# Altium schematic sheet ADC_part3.SchDoc
size A4
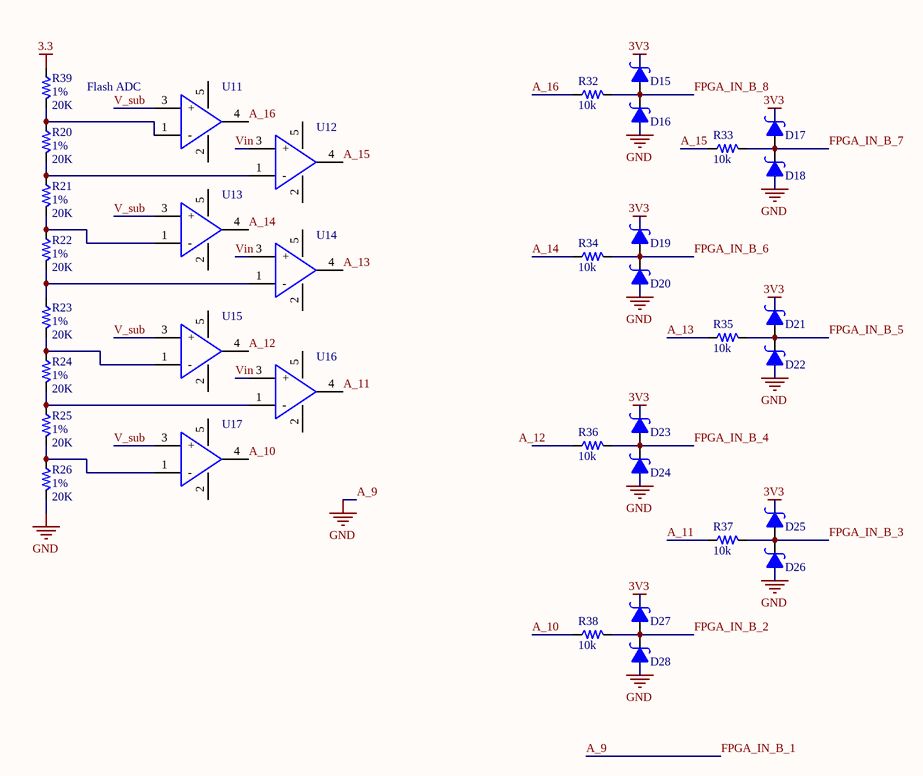
[diagram p0: ADC_part3.SchDoc]

## Parts
D15  ONSEMI_MBRM110LT1G  [ON Semi Schottky Diode - MBRM110LT1G]  (value not drawn)
D16  ONSEMI_MBRM110LT1G  [ON Semi Schottky Diode - MBRM110LT1G]  (value not drawn)
D17  ONSEMI_MBRM110LT1G  [ON Semi Schottky Diode - MBRM110LT1G]  (value not drawn)
D18  ONSEMI_MBRM110LT1G  [ON Semi Schottky Diode - MBRM110LT1G]  (value not drawn)
D19  ONSEMI_MBRM110LT1G  [ON Semi Schottky Diode - MBRM110LT1G]  (value not drawn)
D20  ONSEMI_MBRM110LT1G  [ON Semi Schottky Diode - MBRM110LT1G]  (value not drawn)
D21  ONSEMI_MBRM110LT1G  [ON Semi Schottky Diode - MBRM110LT1G]  (value not drawn)
D22  ONSEMI_MBRM110LT1G  [ON Semi Schottky Diode - MBRM110LT1G]  (value not drawn)
D23  ONSEMI_MBRM110LT1G  [ON Semi Schottky Diode - MBRM110LT1G]  (value not drawn)
D24  ONSEMI_MBRM110LT1G  [ON Semi Schottky Diode - MBRM110LT1G]  (value not drawn)
D25  ONSEMI_MBRM110LT1G  [ON Semi Schottky Diode - MBRM110LT1G]  (value not drawn)
D26  ONSEMI_MBRM110LT1G  [ON Semi Schottky Diode - MBRM110LT1G]  (value not drawn)
D27  ONSEMI_MBRM110LT1G  [ON Semi Schottky Diode - MBRM110LT1G]  (value not drawn)
D28  ONSEMI_MBRM110LT1G  [ON Semi Schottky Diode - MBRM110LT1G]  (value not drawn)
R20  value 20K  Tolerance: 1%  [PCB_GENERIC_SMD_0603]  (hidden comment: R060-00103-01)
R21  value 20K  Tolerance: 1%  [PCB_GENERIC_SMD_0603]  (hidden comment: R060-00103-01)
R22  value 20K  Tolerance: 1%  [PCB_GENERIC_SMD_0603]  (hidden comment: R060-00103-01)
R23  value 20K  Tolerance: 1%  [PCB_GENERIC_SMD_0603]  (hidden comment: R060-00103-01)
R24  value 20K  Tolerance: 1%  [PCB_GENERIC_SMD_0603]  (hidden comment: R060-00103-01)
R25  value 20K  Tolerance: 1%  [PCB_GENERIC_SMD_0603]  (hidden comment: R060-00103-01)
R26  value 20K  Tolerance: 1%  [PCB_GENERIC_SMD_0603]  (hidden comment: R060-00103-01)
R32  value 10k  [PCB_GENERIC_SMD_0603]  (hidden comment: R060-00101-05)
R33  value 10k  [PCB_GENERIC_SMD_0603]  (hidden comment: R060-00101-05)
R34  value 10k  [PCB_GENERIC_SMD_0603]  (hidden comment: R060-00101-05)
R35  value 10k  [PCB_GENERIC_SMD_0603]  (hidden comment: R060-00101-05)
R36  value 10k  [PCB_GENERIC_SMD_0603]  (hidden comment: R060-00101-05)
R37  value 10k  [PCB_GENERIC_SMD_0603]  (hidden comment: R060-00101-05)
R38  value 10k  [PCB_GENERIC_SMD_0603]  (hidden comment: R060-00101-05)
R39  value 20K  Tolerance: 1%  [PCB_GENERIC_SMD_0603]  (hidden comment: R060-00103-01)
U11  AP331A  [SOT95P285X130-5N]  (value not drawn)
U12  AP331A  [SOT95P285X130-5N]  (value not drawn)
U13  AP331A  [SOT95P285X130-5N]  (value not drawn)
U14  AP331A  [SOT95P285X130-5N]  (value not drawn)
U15  AP331A  [SOT95P285X130-5N]  (value not drawn)
U16  AP331A  [SOT95P285X130-5N]  (value not drawn)
U17  AP331A  [SOT95P285X130-5N]  (value not drawn)

## Nets
3.3: R39.1
3V3: D15.1 D17.1 D19.1 D21.1 D23.1 D25.1 D27.1
A_9: D16.2 D18.2 D20.2 D22.2 D24.2 D26.2 D28.2 R26.2  [also labelled FPGA_IN_B_1, GND]
A_10: R38.1 U17.4(VOUT)
A_11: R37.1 U16.4(VOUT)
A_12: U15.4(VOUT)
A_13: R35.1 U14.4(VOUT)
A_14: R34.1 U13.4(VOUT)
A_15: R33.1 U12.4(VOUT)
A_16: R32.1 U11.4(VOUT)
FPGA_IN_B_2: D27.2 D28.1 R38.2
FPGA_IN_B_3: D25.2 D26.1 R37.2
FPGA_IN_B_4: D23.2 D24.1 R36.2
FPGA_IN_B_5: D21.2 D22.1 R35.2
FPGA_IN_B_6: D19.2 D20.1 R34.2
FPGA_IN_B_7: D17.2 D18.1 R33.2
FPGA_IN_B_8: D15.2 D16.1 R32.2
V_sub: U11.3(+) U13.3(+) U15.3(+) U17.3(+)
Vin: U12.3(+) U14.3(+) U16.3(+)
NetR20_1: R20.1 R39.2 U11.1(-)
NetR20_2: R20.2 R21.1 U12.1(-)
NetR21_2: R21.2 R22.1 U13.1(-)
NetR22_2: R22.2 R23.1 U14.1(-)
NetR23_2: R23.2 R24.1 U15.1(-)
NetR24_2: R24.2 R25.1 U16.1(-)
NetR25_2: R25.2 R26.1 U17.1(-)

Not connected (* = marked no-connect by the designer): R36 1; U11 2(GND) 5(VCC); U12 2(GND) 5(VCC); U13 2(GND) 5(VCC); U14 2(GND) 5(VCC); U15 2(GND) 5(VCC); U16 2(GND) 5(VCC); U17 2(GND) 5(VCC)

## Notes on the sheet
- Flash ADC
- Labels drawn without touching a wire or pin: A_12

## Library data of the parts
D15-D28 = ONSEMI_MBRM110LT1G: DIODE SCHOTTKY 10V 1A; Supplier 1: Digi-Key; Supplier Part Number 1: MBRM110LT1GOSDKR-ND
R20-R26 R39 = R060-00103-01: RES 0603 10K 1% 100mW; Power: 100mW; Package: 0603
R32-R38 = R060-00101-05: RES 0603 100ohm 5% 63mW; Tolerance: 5%; Power: 63mW; Package: 0603
U11-U17 = AP331A: Single Channel Comparator, Open Drain, SC-74A/SOT-753; Supplier 1: Digikey; Supplier Part Number 1: AP331AWGDICT-ND